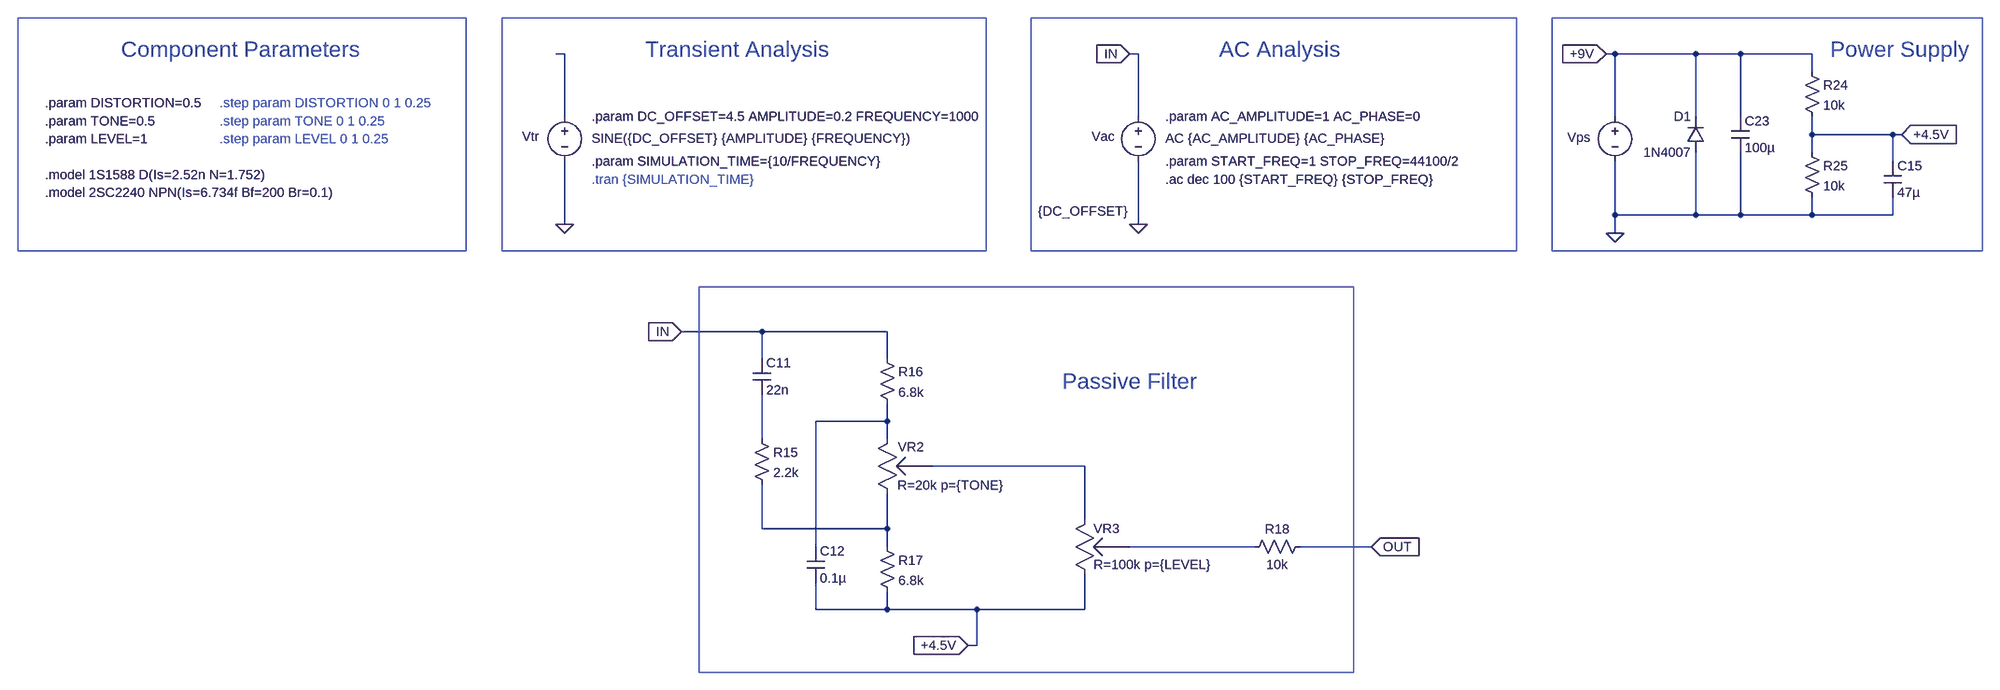
[diagram p0: schematic 5. Passive Filter.asc]
5. Passive Filter.asc, the LTspice schematic file:
Version 4
SHEET 1 6076 2100
WIRE 16 16 0 16
WIRE 1040 16 1024 16
WIRE 1904 16 1888 16
WIRE 2048 16 1904 16
WIRE 2128 16 2048 16
WIRE 2256 16 2128 16
WIRE 2256 48 2256 16
WIRE 16 128 16 16
WIRE 1040 128 1040 16
WIRE 1904 128 1904 16
WIRE 2048 128 2048 16
WIRE 2128 128 2128 16
WIRE 2256 160 2256 128
WIRE 2400 160 2256 160
WIRE 2416 160 2400 160
WIRE 2256 192 2256 160
WIRE 2400 208 2400 160
WIRE 1904 304 1904 208
WIRE 2048 304 2048 192
WIRE 2048 304 1904 304
WIRE 2128 304 2128 192
WIRE 2128 304 2048 304
WIRE 2256 304 2256 272
WIRE 2256 304 2128 304
WIRE 2400 304 2400 272
WIRE 2400 304 2256 304
WIRE 16 320 16 208
WIRE 1040 320 1040 208
WIRE 1904 336 1904 304
WIRE 368 512 224 512
WIRE 592 512 368 512
WIRE 368 560 368 512
WIRE 592 560 592 512
WIRE 592 672 592 640
WIRE 592 672 464 672
WIRE 368 704 368 624
WIRE 592 704 592 672
WIRE 944 752 672 752
WIRE 944 848 944 752
WIRE 368 864 368 784
WIRE 592 864 592 800
WIRE 592 864 368 864
WIRE 464 896 464 672
WIRE 592 896 592 864
WIRE 1248 896 1024 896
WIRE 1456 896 1328 896
WIRE 464 1008 464 960
WIRE 592 1008 592 976
WIRE 592 1008 464 1008
WIRE 752 1008 592 1008
WIRE 944 1008 944 944
WIRE 944 1008 752 1008
WIRE 752 1072 752 1008
WIRE 752 1072 736 1072
FLAG 1904 336 0
FLAG 1888 16 +9V
IOPIN 1888 16 In
FLAG 2416 160 +4.5V
IOPIN 2416 160 In
FLAG 1040 320 0
FLAG 16 320 0
FLAG 1456 896 OUT
IOPIN 1456 896 In
FLAG 736 1072 +4.5V
IOPIN 736 1072 In
FLAG 1024 16 IN
IOPIN 1024 16 In
FLAG 224 512 IN
IOPIN 224 512 In
SYMBOL voltage 1904 112 R0
WINDOW 0 -85 53 Left 2
WINDOW 3 24 96 Invisible 2
WINDOW 123 0 0 Left 0
WINDOW 39 0 0 Left 0
SYMATTR InstName Vps
SYMATTR Value 9
SYMBOL cap 2112 128 R0
SYMATTR InstName C23
SYMATTR Value 100µ
SYMBOL cap 2384 208 R0
SYMATTR InstName C15
SYMATTR Value 47µ
SYMBOL res 2240 32 R0
SYMATTR InstName R24
SYMATTR Value 10k
SYMBOL res 2240 176 R0
SYMATTR InstName R25
SYMATTR Value 10k
SYMBOL diode 2064 192 R180
WINDOW 0 24 64 Left 2
WINDOW 3 24 0 Left 2
SYMATTR InstName D1
SYMATTR Value 1N4007
SYMBOL voltage 1040 112 R0
WINDOW 3 -179 185 Left 2
WINDOW 123 48 55 Left 2
WINDOW 39 0 0 Left 0
WINDOW 0 -83 52 Left 2
SYMATTR Value {DC_OFFSET}
SYMATTR Value2 AC {AC_AMPLITUDE} {AC_PHASE}
SYMATTR InstName Vac
SYMBOL voltage 16 112 R0
WINDOW 3 48 55 Left 2
WINDOW 123 29 129 Left 2
WINDOW 39 0 0 Left 0
WINDOW 0 -76 52 Left 2
SYMATTR Value SINE({DC_OFFSET} {AMPLITUDE} {FREQUENCY})
SYMATTR InstName Vtr
SYMBOL cap 352 560 R0
SYMATTR InstName C11
SYMATTR Value 22n
SYMBOL res 352 688 R0
SYMATTR InstName R15
SYMATTR Value 2.2k
SYMBOL res 576 544 R0
SYMATTR InstName R16
SYMATTR Value 6.8k
SYMBOL pot 576 800 M180
WINDOW 39 34 14 Left 2
WINDOW 0 35 82 Left 2
SYMATTR SpiceLine R=20k p={TONE}
SYMATTR InstName VR2
SYMBOL res 576 880 R0
SYMATTR InstName R17
SYMATTR Value 6.8k
SYMBOL cap 448 896 R0
SYMATTR InstName C12
SYMATTR Value 0.1µ
SYMBOL pot 928 848 R0
SYMATTR SpiceLine R=100k p={LEVEL}
SYMATTR InstName VR3
SYMBOL res 1344 880 R90
WINDOW 0 0 56 VBottom 2
WINDOW 3 32 56 VTop 2
SYMATTR InstName R18
SYMATTR Value 10k
TEXT 2288 8 Left 4 ;Power Supply
TEXT -776 8 Left 4 ;Component Parameters
TEXT 1088 240 Left 2 !.ac dec 100 {START_FREQ} {STOP_FREQ}
TEXT 64 240 Left 2 ;.tran {SIMULATION_TIME}
TEXT -600 104 Left 2 ;.step param DISTORTION 0 1 0.25
TEXT -600 136 Left 2 ;.step param TONE 0 1 0.25
TEXT 904 600 Left 4 ;Passive Filter
TEXT 64 208 Left 2 !.param SIMULATION_TIME={10/FREQUENCY}
TEXT 160 8 Left 4 ;Transient Analysis
TEXT 64 128 Left 2 !.param DC_OFFSET=4.5 AMPLITUDE=0.2 FREQUENCY=1000
TEXT 1184 8 Left 4 ;AC Analysis
TEXT 1088 128 Left 2 !.param AC_AMPLITUDE=1 AC_PHASE=0
TEXT 1088 208 Left 2 !.param START_FREQ=1 STOP_FREQ=44100/2
TEXT -912 264 Left 2 !.model 2SC2240 NPN(Is=6.734f Bf=200 Br=0.1)
TEXT -912 232 Left 2 !.model 1S1588 D(Is=2.52n N=1.752)
TEXT -912 136 Left 2 !.param TONE=0.5
TEXT -912 168 Left 2 !.param LEVEL=1
TEXT -600 168 Left 2 ;.step param LEVEL 0 1 0.25
TEXT -912 104 Left 2 !.param DISTORTION=0.5
RECTANGLE Normal 1424 1120 256 432
RECTANGLE Normal 768 368 -96 -48
RECTANGLE Normal 1728 368 848 -48
RECTANGLE Normal 2560 368 1792 -48
RECTANGLE Normal -160 368 -960 -48

The netlist it stands for:
* 5. Passive Filter.asc
Vps +9V 0 9
C23 +9V 0 100µ
C15 +4.5V 0 47µ
R24 +9V +4.5V 10k
R25 +4.5V 0 10k
D1 0 +9V 1N4007
Vac IN 0 {DC_OFFSET} AC {AC_AMPLITUDE} {AC_PHASE}
Vtr N001 0 SINE({DC_OFFSET} {AMPLITUDE} {FREQUENCY})
C11 IN N003 22n
R15 N003 N005 2.2k
R16 IN N002 6.8k
XVR2 N005 N004 N002 pot R=20k p={TONE}  ; pins 1 2 3
R17 N005 +4.5V 6.8k
C12 N002 +4.5V 0.1µ
XVR3 N004 N006 +4.5V pot R=100k p={LEVEL}  ; pins 1 2 3
R18 OUT N006 10k
.model D D
.lib standard.dio
* Power Supply
* Component Parameters
.ac dec 100 {START_FREQ} {STOP_FREQ}
* .tran {SIMULATION_TIME}
* .step param DISTORTION 0 1 0.25
* .step param TONE 0 1 0.25
* Passive Filter
.param SIMULATION_TIME={10/FREQUENCY}
* Transient Analysis
.param DC_OFFSET=4.5 AMPLITUDE=0.2 FREQUENCY=1000
* AC Analysis
.param AC_AMPLITUDE=1 AC_PHASE=0
.param START_FREQ=1 STOP_FREQ=44100/2
.model 2SC2240 NPN(Is=6.734f Bf=200 Br=0.1)
.model 1S1588 D(Is=2.52n N=1.752)
.param TONE=0.5
.param LEVEL=1
* .step param LEVEL 0 1 0.25
.param DISTORTION=0.5
.backanno
.end